# Altium schematic sheet Connector.SchDoc
size A2; SheetNumber: 4; SheetTotal: 5
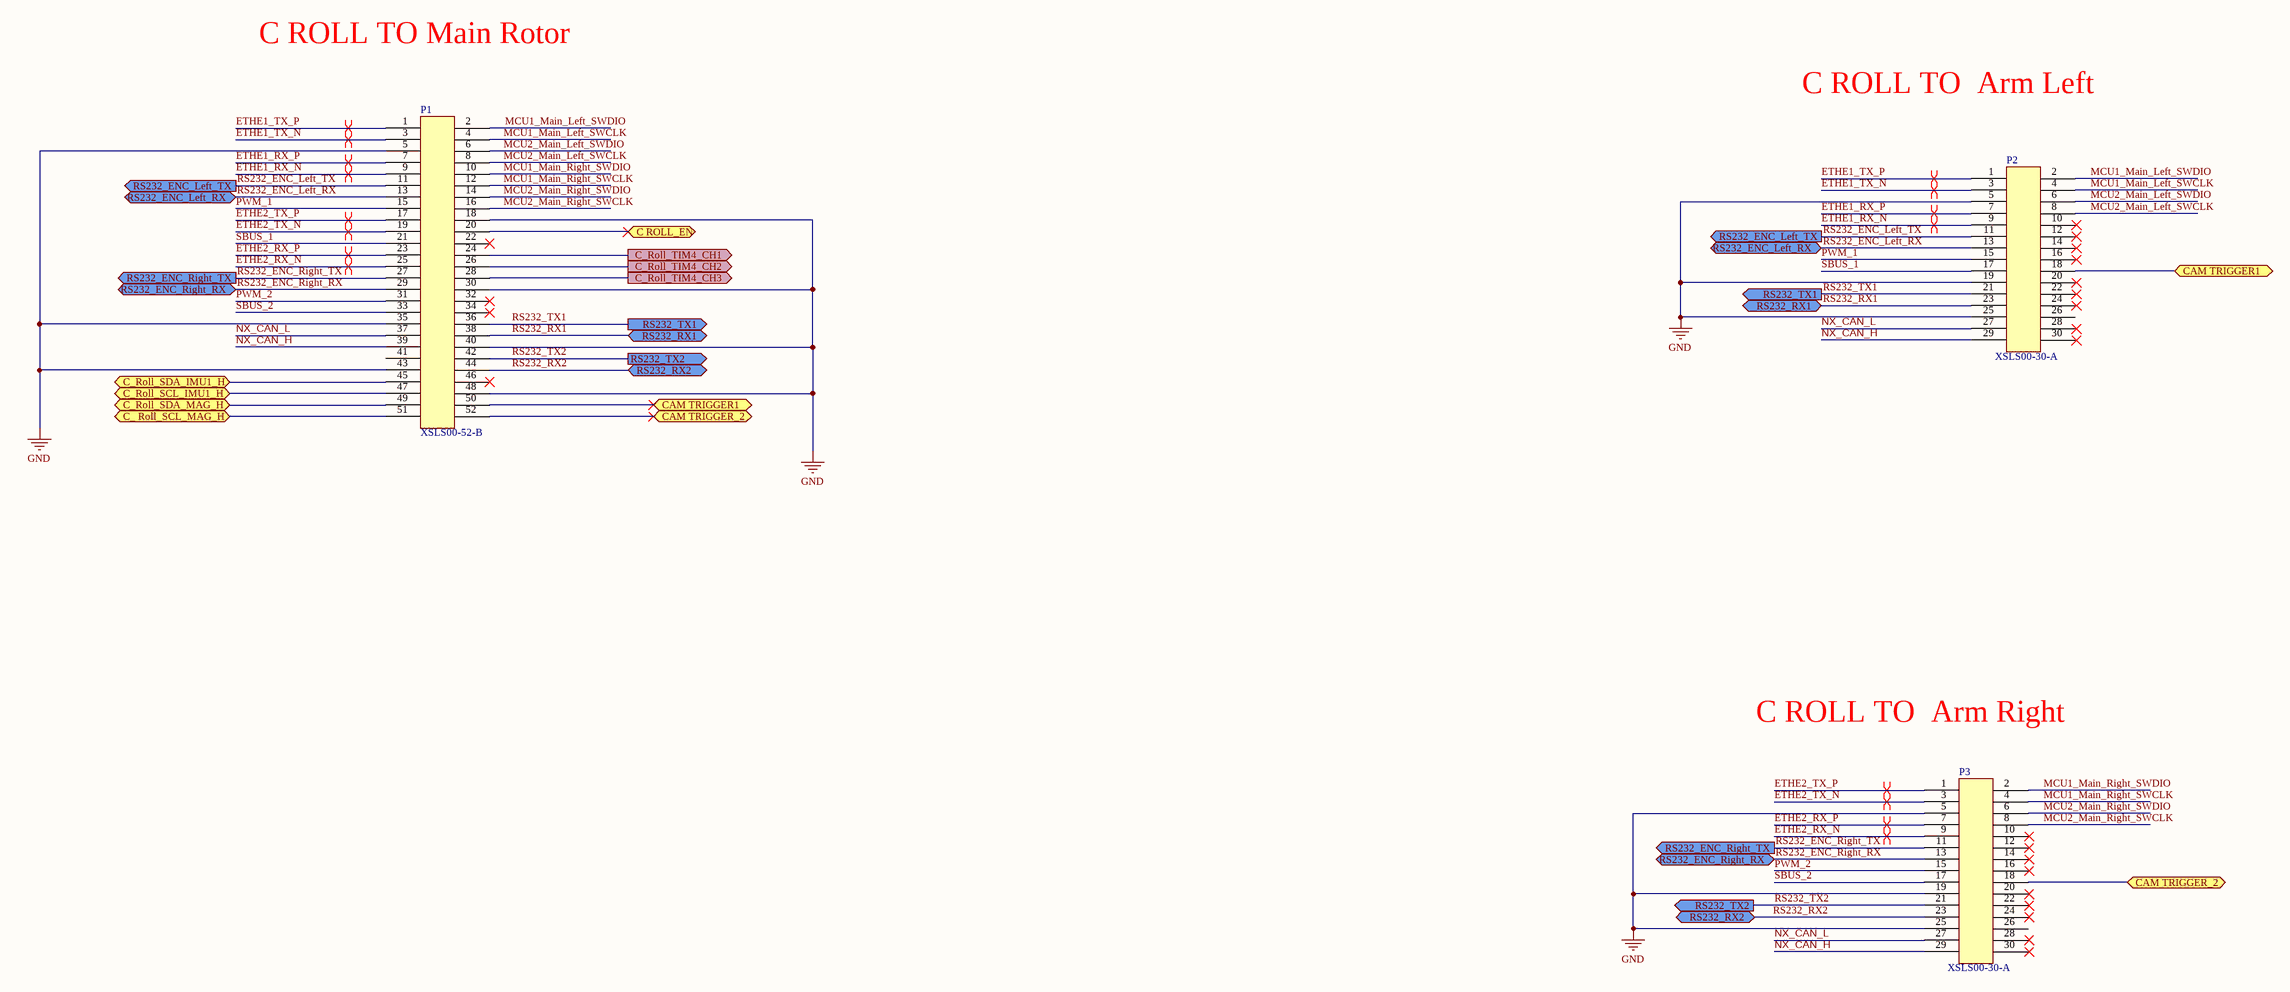
[diagram p0: Connector.SchDoc]

## Parts
P1  XSLS00-52-B  [XSXL52]
P2  XSLS00-30-A  [XSXL30]
P3  XSLS00-30-A  [XSXL30]

## Ports
C ROLL_EN (bidir), C_ Roll_SCL_MAG_H (bidir), C_Roll_SCL_IMU1_H (bidir), C_Roll_SDA_IMU1_H (bidir), C_Roll_SDA_MAG_H (bidir), C_Roll_TIM4_CH1 (out), C_Roll_TIM4_CH2 (out), C_Roll_TIM4_CH3 (out), CAM TRIGGER1 (bidir), CAM TRIGGER_2 (bidir), RS232_ENC_Left_RX (bidir), RS232_ENC_Left_TX (out), RS232_ENC_Right_RX (bidir), RS232_ENC_Right_TX (out), RS232_RX1 (bidir), RS232_RX2 (bidir), RS232_TX1 (out), RS232_TX2 (out)

## Nets
GND: P1.5 P1.18 P1.30 P1.35 P1.40 P1.43 P1.48 P2.5 P2.19 P2.25 P3.5 P3.19 P3.25
C ROLL_EN: P1.20 ; port C ROLL_EN
C_ Roll_SCL_MAG_H: P1.51 ; port C_ Roll_SCL_MAG_H
C_Roll_SCL_IMU1_H: P1.47 ; port C_Roll_SCL_IMU1_H
C_Roll_SDA_IMU1_H: P1.45 ; port C_Roll_SDA_IMU1_H
C_Roll_SDA_MAG_H: P1.49 ; port C_Roll_SDA_MAG_H
C_Roll_TIM4_CH1: P1.24 ; port C_Roll_TIM4_CH1
C_Roll_TIM4_CH2: P1.26 ; port C_Roll_TIM4_CH2
C_Roll_TIM4_CH3: P1.28 ; port C_Roll_TIM4_CH3
CAM TRIGGER1: P1.50 P2.18 ; port CAM TRIGGER1
CAM TRIGGER_2: P1.52 P3.18 ; port CAM TRIGGER_2
ETHE1_RX_N: P1.9 P2.9
ETHE1_RX_P: P1.7 P2.7
ETHE1_TX_N: P1.3 P2.3
ETHE1_TX_P: P1.1 P2.1
ETHE2_RX_N: P1.25 P3.9
ETHE2_RX_P: P1.23 P3.7
ETHE2_TX_N: P1.19 P3.3
ETHE2_TX_P: P1.17 P3.1
MCU1_Main_Left_SWCLK: P1.4 P2.4
MCU1_Main_Left_SWDIO: P1.2 P2.2
MCU1_Main_Right_SWCLK: P1.12 P3.4
MCU1_Main_Right_SWDIO: P1.10 P3.2
MCU2_Main_Left_SWCLK: P1.8 P2.8
MCU2_Main_Left_SWDIO: P1.6 P2.6
MCU2_Main_Right_SWCLK: P1.16 P3.8
MCU2_Main_Right_SWDIO: P1.14 P3.6
NX_CAN_H: P1.39 P2.29 P3.29
NX_CAN_L: P1.37 P2.27 P3.27
PWM_1: P1.15 P2.15
PWM_2: P1.31 P3.15
RS232_ENC_Left_RX: P1.13 P2.13 ; port RS232_ENC_Left_RX
RS232_ENC_Left_TX: P1.11 P2.11 ; port RS232_ENC_Left_TX
RS232_ENC_Right_RX: P1.29 P3.13 ; port RS232_ENC_Right_RX
RS232_ENC_Right_TX: P1.27 P3.11 ; port RS232_ENC_Right_TX
RS232_RX1: P1.38 P2.23 ; port RS232_RX1
RS232_RX2: P1.44 P3.23 ; port RS232_RX2
RS232_TX1: P1.36 P2.21 ; port RS232_TX1
RS232_TX2: P1.42 P3.21 ; port RS232_TX2
SBUS_1: P1.21 P2.17
SBUS_2: P1.33 P3.17

Not connected (* = marked no-connect by the designer): P1 22* 32* 34* 41 46*; P2 10 12 14 16 20 22 24 26 28 30; P3 10 12 14 16 20 22 24 26 28 30

## Layout directives
differential pair: ETHE1_RX_N, ETHE1_RX_P, ETHE1_TX_N, ETHE1_TX_P, ETHE2_RX_N, ETHE2_RX_P, ETHE2_TX_N, ETHE2_TX_P

## Notes on the sheet
- C ROLL TO Main Rotor
- C ROLL TO  Arm Left
- C ROLL TO  Arm Right